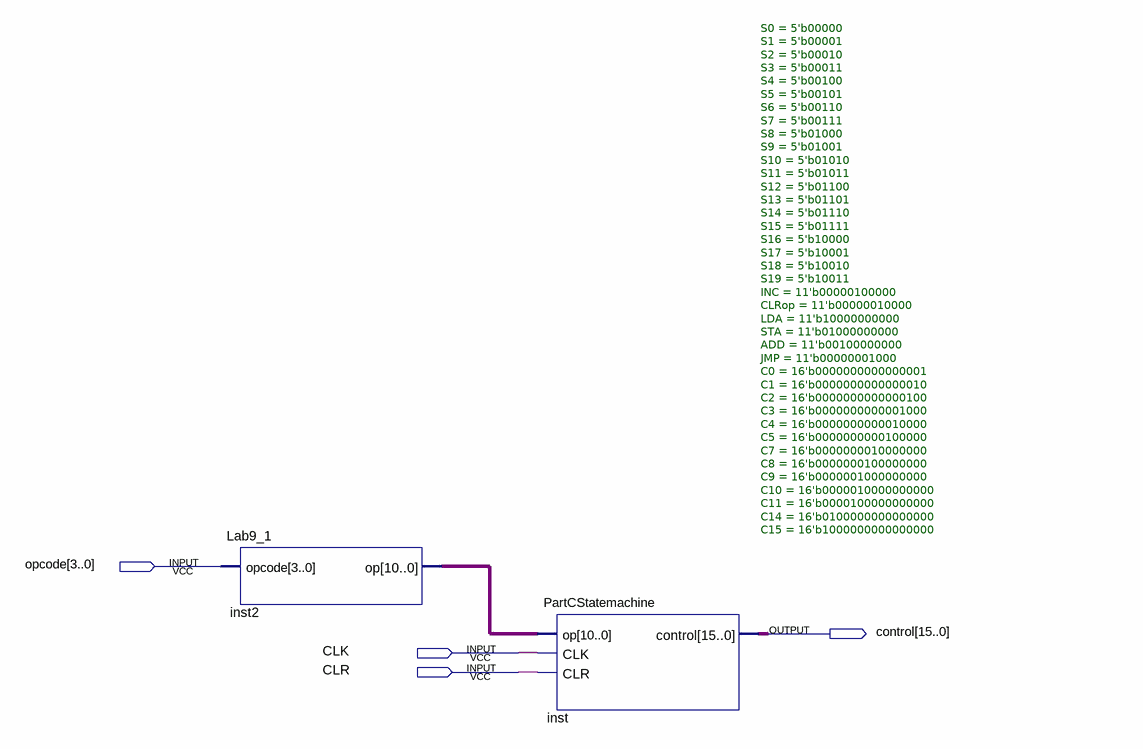
[diagram p0: schematic sheet]
// Quartus schematic PartCController.bdf as structural Verilog: 2 symbols, 4 pins
module PartCController (
  input  [3:0] opcode,
  input  CLK,
  input  CLR,
  output [15:0] control
);

  wire [10:0] inst2_op;

  Lab9_1 inst2 (.opcode(opcode), .op(inst2_op));
  PartCStatemachine #(.S0(5'b00000), .S1(5'b00001), .S2(5'b00010), .S3(5'b00011), .S4(5'b00100), .S5(5'b00101), .S6(5'b00110), .S7(5'b00111), .S8(5'b01000), .S9(5'b01001), .S10(5'b01010), .S11(5'b01011), .S12(5'b01100), .S13(5'b01101), .S14(5'b01110), .S15(5'b01111), .S16(5'b10000), .S17(5'b10001), .S18(5'b10010), .S19(5'b10011), .INC(11'b00000100000), .CLRop(11'b00000010000), .LDA(11'b10000000000), .STA(11'b01000000000), .ADD(11'b00100000000), .JMP(11'b00000001000), .C0(16'b0000000000000001), .C1(16'b0000000000000010), .C2(16'b0000000000000100), .C3(16'b0000000000001000), .C4(16'b0000000000010000), .C5(16'b0000000000100000), .C7(16'b0000000010000000), .C8(16'b0000000100000000), .C9(16'b0000001000000000), .C10(16'b0000010000000000), .C11(16'b0000100000000000), .C14(16'b0100000000000000), .C15(16'b1000000000000000)) inst (
    .op(inst2_op), .CLK(CLK), .CLR(CLR), .control(control));
endmodule
